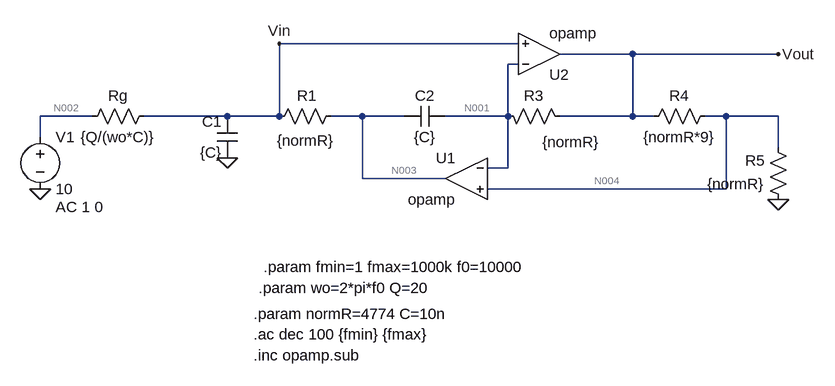
[diagram p0: schematic simulacion.asc]
simulacion.asc, the LTspice schematic file:
Version 4
SHEET 1 1152 1072
WIRE 192 544 -176 544
WIRE 368 560 256 560
WIRE 592 560 368 560
WIRE 192 576 176 576
WIRE -464 656 -544 656
WIRE -256 656 -384 656
WIRE -176 656 -176 544
WIRE -176 656 -256 656
WIRE -48 656 -96 656
WIRE 16 656 -48 656
WIRE 176 656 176 576
WIRE 176 656 80 656
WIRE 368 656 368 560
WIRE 368 656 256 656
WIRE 400 656 368 656
WIRE 512 656 480 656
WIRE 592 656 512 656
WIRE -544 688 -544 656
WIRE 592 704 592 656
WIRE 176 736 176 656
WIRE 176 736 144 736
WIRE -48 752 -48 656
WIRE 80 752 -48 752
WIRE 512 768 512 656
WIRE 512 768 144 768
FLAG -176 544 Vin
FLAG 592 560 Vout
FLAG -544 768 0
FLAG 592 784 0
FLAG -256 720 0
SYMBOL OpAmps\\opamp 112 688 M0
SYMATTR InstName U1
SYMBOL res -80 640 R90
WINDOW 0 0 53 VBottom 2
WINDOW 3 38 55 VTop 2
SYMATTR InstName R1
SYMATTR Value {normR}
SYMBOL res 272 672 M270
WINDOW 0 32 56 VTop 2
WINDOW 3 -8 -2 VBottom 2
SYMATTR InstName R3
SYMATTR Value {normR}
SYMBOL cap -240 720 R180
WINDOW 0 24 56 Left 2
WINDOW 3 24 8 Left 2
SYMATTR InstName C1
SYMATTR Value {C}
SYMBOL voltage -544 672 R0
WINDOW 123 24 124 Left 2
WINDOW 39 0 0 Left 0
SYMATTR Value2 AC 1 0
SYMATTR InstName V1
SYMATTR Value 10
SYMBOL OpAmps\\opamp 224 624 M180
SYMATTR InstName U2
SYMBOL res 496 640 R90
WINDOW 0 0 56 VBottom 2
WINDOW 3 32 56 VTop 2
SYMATTR InstName R4
SYMATTR Value {normR*9}
SYMBOL res 608 800 R180
WINDOW 0 36 76 Left 2
WINDOW 3 36 40 Left 2
SYMATTR InstName R5
SYMATTR Value {normR}
SYMBOL res -368 640 R90
WINDOW 0 0 56 VBottom 2
WINDOW 3 32 56 VTop 2
SYMATTR InstName Rg
SYMATTR Value {Q/(wo*C)}
SYMBOL cap 80 640 R90
WINDOW 0 0 32 VBottom 2
WINDOW 3 32 32 VTop 2
SYMATTR InstName C2
SYMATTR Value {C}
TEXT -216 960 Left 2 !.param normR=4774 C=10n
TEXT -216 992 Left 2 !.ac dec 100 {fmin} {fmax}
TEXT -216 1024 Left 2 !.inc opamp.sub
TEXT -208 920 Left 2 !.param wo=2*pi*f0 Q=20
TEXT -200 888 Left 2 !.param fmin=1 fmax=1000k f0=10000

The netlist it stands for:
* simulacion.asc
XU1 N001 N004 N003 opamp Aol=100K GBW=10Meg  ; pins invin noninvin out
R1 N003 Vin {normR}
R3 Vout N001 {normR}
C1 0 Vin {C}
V1 N002 0 10 AC 1 0
XU2 N001 Vin Vout opamp Aol=100K GBW=10Meg  ; pins invin noninvin out
R4 N004 Vout {normR*9}
R5 0 N004 {normR}
Rg Vin N002 {Q/(wo*C)}
C2 N001 N003 {C}
.param normR=4774 C=10n
.ac dec 100 {fmin} {fmax}
.inc opamp.sub
.param wo=2*pi*f0 Q=20
.param fmin=1 fmax=1000k f0=10000
.backanno
.end

* Results of the author's LTspice run, read from the files saved beside the schematic
* Operating Point, zero values left out:
*   V(n003) = -1.5 V
*   V(n004) = 1.667 µV
*   V(n001) = 16.67 µV
*   V(vin) = 16.67 µV
*   V(vout) = 16.67 µV
*   V(n002) = 10 V
*   I(R1) = -314.2 µA
*   I(R4) = -349.1 pA
*   I(R5) = -349.1 pA
*   I(Rg) = -314.2 µA
*   I(V1) = -314.2 µA
*   Ix(u1:3) = 314.2 µA
*   Ix(u2:3) = -349.1 pA
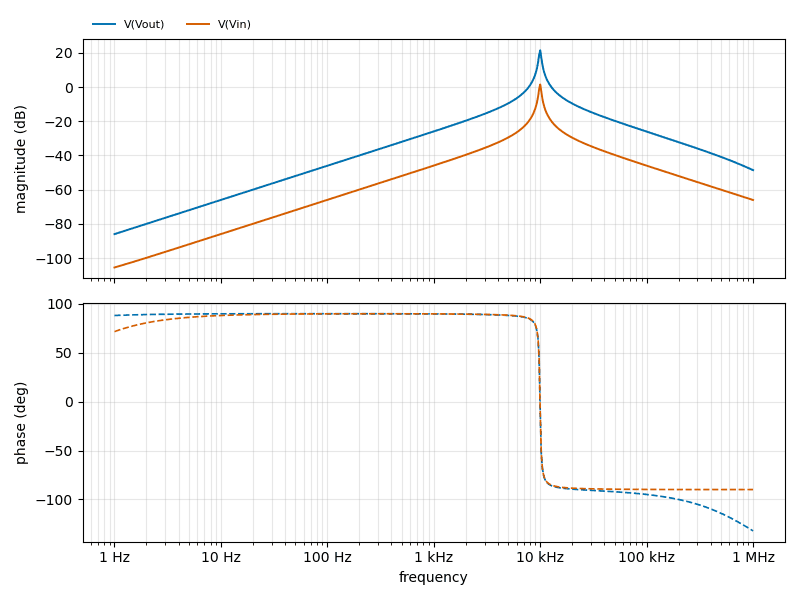
[diagram p1: AC Analysis of simulacion.asc, plotted from the saved traces]
* AC Analysis, 1 run:
*   V(Vout): -86.02 dB at 1 Hz, -48.58 dB at 1 MHz, peak 21.53 dB at 10 kHz, 3 dB below the peak at 9.758 kHz and 10.17 kHz
*   V(Vin): -105.54 dB at 1 Hz, -66.04 dB at 1 MHz, peak 1.56 dB at 10 kHz, 3 dB below the peak at 9.758 kHz and 10.17 kHz